# Altium project RGBWLEDDriver.PrjPcb
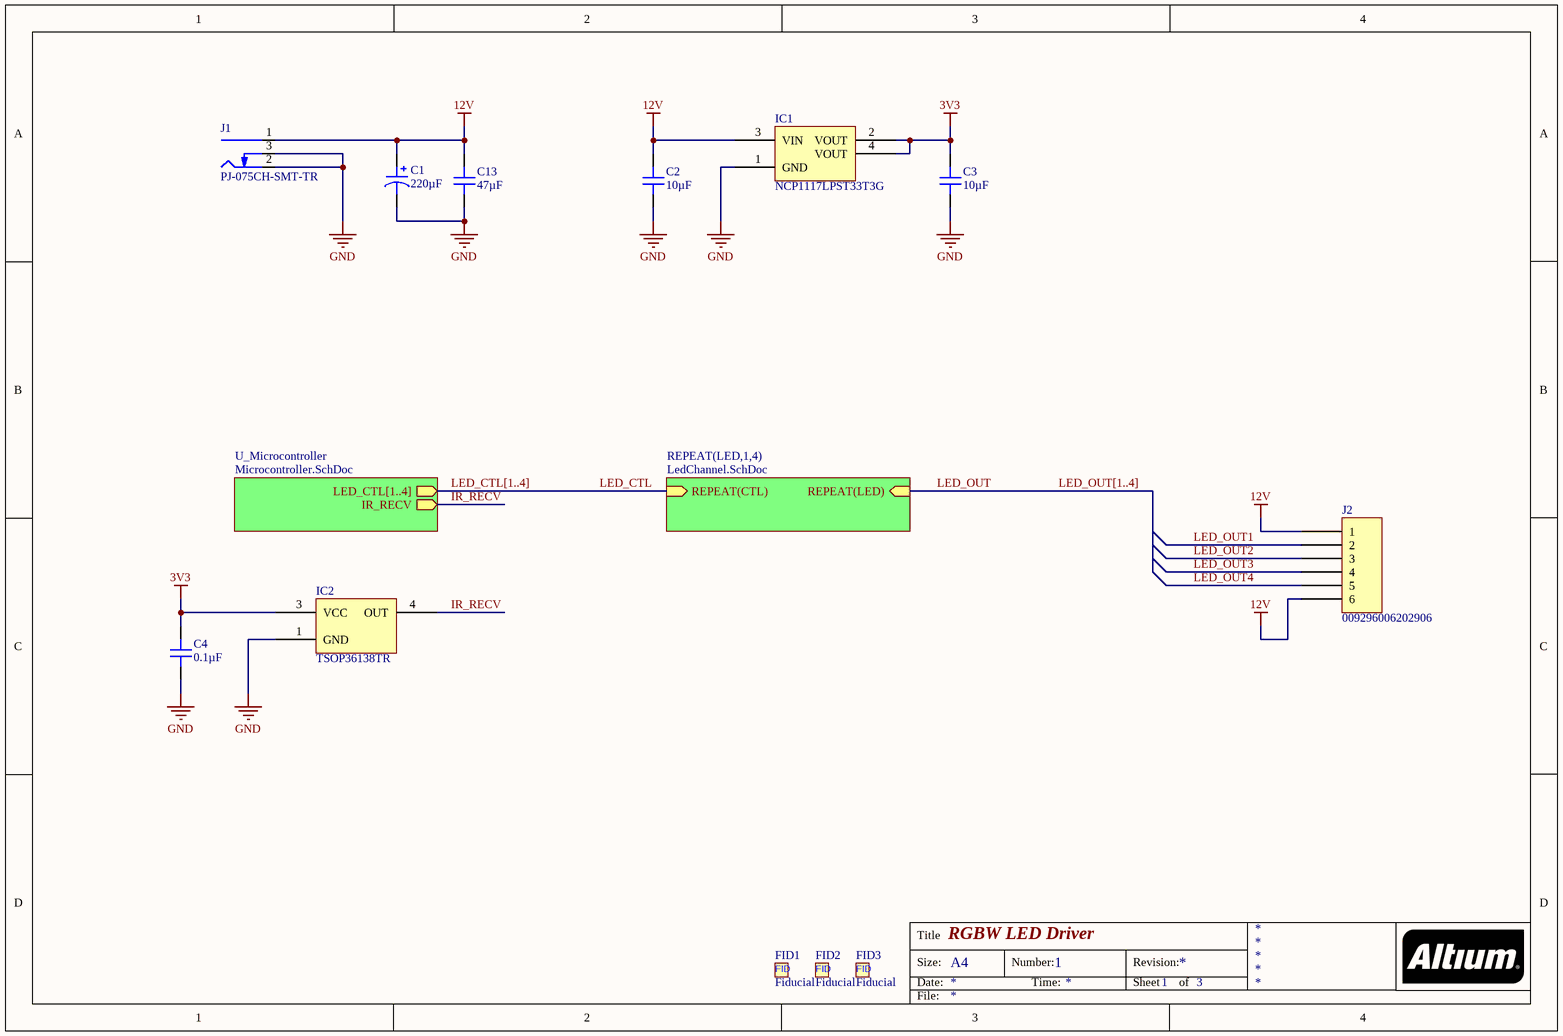
[diagram p0: Top.SchDoc]
3 sheets, 53 parts. Net scope: hierarchical (ports join the sheet entries above them; power ports are global).
Board files: LED Controller.PcbDoc, LED Controller Panel.PcbDoc
Sheets:
  Top.SchDoc
    U_Microcontroller = Microcontroller.SchDoc
    LED1 = LedChannel.SchDoc
    LED2 = LedChannel.SchDoc
    LED3 = LedChannel.SchDoc
    LED4 = LedChannel.SchDoc

## Sheet Top.SchDoc: RGBW LED Driver
size A4; DocumentNumber: 1; SheetNumber: 1; SheetTotal: 3

### Parts
C1  220µF  [CAP ALSMD 8.3MM H10.5MM]
C2  10µF  [CAP 1206_3216 - 1.8MM]
C3  10µF  [CAP 1206_3216 - 1.8MM]
C4  0.1µF  [CAP 0603_1608]
C13  47µF  [CAP 1206_3216 - 1.8MM]
FID1  Fiducial  [Fiducial-1mm]
FID2  Fiducial  [Fiducial-1mm]
FID3  Fiducial  [Fiducial-1mm]
IC1  NCP1117LPST33T3G  [ON SEMI SOT-223 ST(318H)]
IC2  TSOP36138TR  [VISHAY TSOP36X-TR]
J1  PJ-075CH-SMT-TR  [CUI PJ-075-SMT]
J2  009296006202906  [AVX 9296006202806]

### Sub-sheets
REPEAT(LED,1,4) = LedChannel.SchDoc: REPEAT(CTL) (in), REPEAT(LED) (in)
U_Microcontroller = Microcontroller.SchDoc: LED_CTL[1..4] (out), IR_RECV (out)

### Nets
3V3: C3.2 C4.2 IC1.2(VOUT) IC1.4(VOUT) IC2.3(VCC)
12V: C1.1 C2.2 C13.2 IC1.3(VIN) J1.1(Centre) J2.1 J2.6
GND: C1.2 C2.1 C3.1 C4.1 C13.1 IC1.1(GND) IC2.1(GND) J1.2(Outer) J1.3(SW)
IR_RECV: IC2.4(OUT) ; sheet U_Microcontroller/IR_RECV
LED_CTL: sheet REPEAT(LED,1,4)/REPEAT(CTL)
LED_OUT: sheet REPEAT(LED,1,4)/REPEAT(LED)
LED_OUT1: J2.2  [project net LED]
LED_OUT2: J2.3  [project net LED]
LED_OUT3: J2.4  [project net LED]
LED_OUT4: J2.5  [project net LED]

### Buses and harness runs
bus LED_CTL[1..4] = sheet U_Microcontroller/LED_CTL[1..4]
bus LED_OUT[1..4]

### Notes on the sheet
- Title
- Size:
- Date:
- A4
- Number:
- Time:
- Revision:
- Sheet
- of
- File:
- (in symbol Fiducial) FID

### Library data of the parts
C1 = UUX1E221MNL6GS: CAP ALUM 220UF 20% 25V SMD; Manufacturer: Nichicon; Lifetime @ Temp.: 2000 Hrs @ 105°C; Polarization: Polar; Ripple Current @ High Frequency: 367.9mA @ 10kHz; Ripple Current @ Low Frequency: 283mA @ 120Hz; Surface Mount Land Size: 0.327" L x 0.327" W (8.30mm x 8.30mm); Part Number: UUX1E221MNL6GS; Applications: General Purpose; Capacitance: 220µF; ComponentLink1Description: Datasheet; ComponentLink1URL: http://nichicon-us.com/english/products/pdfs/e-uux.pdf; ComponentLink2Description: DigiKey Link; ComponentLink2URL: http://digikey.com/product-detail/en/nichicon/UUX1E221MNL6GS/493-9620-1-ND/3962952; Device Package: Radial, Can - SMD; Height - Seated (Max): 0.413" (10.50mm); LastUpdated: 21/01/2020 04:02:43; Lifecycle Status: Active; Minimum Order: 1; Mounting Type: Surface Mount; Operating Temperature: -55°C ~ 105°C; Package / Case: Radial, Can - SMD; Packaging: TapeAndReel; PartId: 7707; Part Status: Active; Price: 0.16; Series: UUX; Size / Dimension: 0.315" Dia (8.00mm); Supplier 1: DigiKey; Supplier Part Number 1: 493-9620-1-ND; Tolerance: ±20%; Value: 220µF; Voltage - Rated: 25V
C2 C3 = CL31A106KAHNNNE: CAP CER 10UF 25V X5R 1206; Manufacturer: Samsung Electro-Mechanics; Tolerance: ±10%; Part Number: CL31A106KAHNNNE; Value: 10µF; Applications: General Purpose; Capacitance: 10µF; ComponentLink1Description: Datasheet; ComponentLink1URL: http://www.samsungsem.com/kr/support/product-search/mlcc/CL31A106KAHNNNE.jsp; ComponentLink2Description: DigiKey Link; ComponentLink2URL: http://digikey.com/product-detail/en/samsung-electro-mechanics/CL31A106KAHNNNE/1276-1075-1-ND/3889161; Device Package: 1206 (3216 Metric); LastUpdated: 21/01/2020 00:03:42; Lifecycle Status: Active; Minimum Order: 1; Mounting Type: Surface Mount, MLCC; Operating Temperature: -55°C ~ 85°C; Package / Case: 1206 (3216 Metric); Packaging: TapeAndReel; PartId: 21774; Part Status: Active; Price: 0.04; Series: CL; Size / Dimension: 0.126" L x 0.063" W (3.20mm x 1.60mm); Supplier 1: DigiKey; Supplier Part Number 1: 1276-1075-1-ND; Temperature Coefficient: X5R; Thickness (Max): 0.071" (1.80mm); Voltage - Rated: 25V
C4 = CS0603KRX7R7BB104: CAP CER 0.1UF 16V X7R 0603; Manufacturer: Yageo; Tolerance: ±10%; Part Number: CS0603KRX7R7BB104; Value: 0.1µF; Applications: Boardflex Sensitive; Capacitance: 0.1µF; ComponentLink1Description: Datasheet; ComponentLink1URL: http://www.yageo.com/NewPortal/yageodocoutput?fileName=/pdf/MLCC/UPY-ST_NPOX7R_16V-to-3KV_5.pdf; ComponentLink2Description: DigiKey Link; ComponentLink2URL: http://digikey.com/product-detail/en/yageo/CS0603KRX7R7BB104/311-3560-1-ND/7648487; Device Package: 0603 (1608 Metric); Features: Soft Termination; LastUpdated: 02/01/2020 00:02:08; Lifecycle Status: Active; Minimum Order: 1; Mounting Type: Surface Mount, MLCC; Operating Temperature: -55°C ~ 125°C; Package / Case: 0603 (1608 Metric); Packaging: ReReel; PartId: 2286; Part Status: Active; Price: 0.00; Series: CS; Size / Dimension: 0.063" L x 0.031" W (1.60mm x 0.80mm); Supplier 1: DigiKey; Supplier Part Number 1: 311-3560-1-ND; Temperature Coefficient: X7R; Thickness (Max): 0.037" (0.95mm); Voltage - Rated: 16V
C13 = GRM31CR61E476ME44L: CAP CER 47UF 25V X5R 1206; Manufacturer: Murata Electronics; Tolerance: ±20%; Part Number: GRM31CR61E476ME44L; Value: 47µF; Applications: General Purpose; Capacitance: 47µF; ComponentLink2Description: DigiKey Link; ComponentLink2URL: http://digikey.com/product-detail/en/murata-electronics/GRM31CR61E476ME44L/490-16268-1-ND/7363259; Device Package: 1206 (3216 Metric); LastUpdated: 21/01/2020 00:03:34; Lifecycle Status: Active; Minimum Order: 1; Mounting Type: Surface Mount, MLCC; Operating Temperature: -55°C ~ 85°C; Package / Case: 1206 (3216 Metric); Packaging: TapeAndReel; PartId: 22811; Part Status: Active; Price: 0.36; Series: GRM; Size / Dimension: 0.126" L x 0.063" W (3.20mm x 1.60mm); Supplier 1: DigiKey; Supplier Part Number 1: 490-16268-1-ND; Temperature Coefficient: X5R; Thickness (Max): 0.071" (1.80mm); Voltage - Rated: 25V
IC1 = NCP1117LPST33T3G: IC REG LINEAR 3.3V 1A SOT223; Manufacturer: ON Semiconductor; Current - Quiescent (Iq): 700µA; Number of Regulators: 1; Output Configuration: Positive; Output Type: Fixed; Protection Features: Over Current, Over Temperature; PSRR: 60dB (120Hz); Voltage Dropout (Max): 1.4V @ 1A; Voltage - Input (Max): 18V; Part Number: NCP1117LPST33T3G; ComponentLink1Description: Datasheet; ComponentLink1URL: http://www.onsemi.com/pub/Collateral/NCP1117LP-D.PDF; ComponentLink2Description: DigiKey Link; ComponentLink2URL: http://digikey.com/product-detail/en/on-semiconductor/NCP1117LPST33T3G/NCP1117LPST33T3GOSCT-ND/3462387; Current - Output: 1A; Device Package: TO-261-4, TO-261AA; LastUpdated: 21/01/2020 03:56:49; Lifecycle Status: Active; Minimum Order: 1; Mounting Type: Surface Mount; Operating Temperature: 0°C ~ 125°C; Package / Case: TO-261-4, TO-261AA; Packaging: TapeAndReel; Part Status: Active; Price: 0.12; Series: -; Supplier 1: DigiKey; Supplier Part Number 1: NCP1117LPST33T3GOSCT-ND; Supplier Device Package: SOT-223; Voltage - Output (Min/Fixed): 3.3V
IC2 = TSOP36138TR: SENSOR REMOTE REC 38.0KHZ 45M; Manufacturer: Vishay Semiconductor Opto Division; Current - Supply: 350µA; Voltage - Supply: 2.5V ~ 5.5V; Part Number: TSOP36138TR; B.P.F. Center Frequency: 38.0kHz; ComponentLink1Description: Datasheet; ComponentLink1URL: http://www.vishay.com/docs/82567/tsop361.pdf; ComponentLink2Description: DigiKey Link; ComponentLink2URL: http://digikey.com/product-detail/en/vishay-semiconductor-opto-division/TSOP36138TR/TSOP36138TRCT-ND/8556857; LastUpdated: 20/04/2020 13:27:50; Lifecycle Status: Active; Minimum Order: 1; Mounting Type: Surface Mount; Operating Temperature: -25°C ~ 85°C (TA); Orientation: Side or Top View; Packaging: TapeAndReel; Part Status: Active; Price: 0.71; Sensing Distance: 45m; Series: -; Supplier 1: DigiKey; Supplier Part Number 1: TSOP36138TRCT-ND
J1 = PJ-075CH-SMT-TR: CONN PWR JACK 1X3.4MM SOLDER; Manufacturer: CUI Devices; Actual Diameter: 0.039" (1.00mm ID), 0.146" (3.70mm OD); Current Rating (Amps): 3.5A; Gender: Male; Industry Recognized Mating Diameter: 1.00mm ID (0.039"), 3.40mm OD (0.134"); Internal Switch(s): Single Switch, Normally Closed; Material Flammability Rating: UL94 V-0; Mating Length/Depth: 0.252" (6.40mm); Number of Positions/Contacts: 2 Conductors, 3 Contacts; Shielding: Unshielded; Voltage - Rated: 24VDC; Part Number: PJ-075CH-SMT-TR; ComponentLink1Description: Datasheet; ComponentLink1URL: https://www.cuidevices.com/product/resource/digikeypdf/pj-075ch-smt-tr.pdf; ComponentLink2Description: DigiKey Link; ComponentLink2URL: //digikey.com/product-detail/en/cui-devices/PJ-075CH-SMT-TR/CP-075CHPJTR-ND/3661519; Connector Type: Jack; Features: Board Guide; LastUpdated: 16/12/2019 19:00:05; Lifecycle Status: 0; Minimum Order: 1; Mounting Type: Surface Mount, Right Angle; Packaging: TapeAndReel; Part Status: Active; Price: 0.56; Series: -; Supplier 1: DigiKey; Supplier Part Number 1: CP-075CHPJTR-ND; Termination: Solder
J2 = 009296006202906: CONN WIRE POKE-IN 6POS SMD RA; Manufacturer: AVX Corporation; Board-Side Pitch: 0.118" (3.00mm); Connector Type: Individual Wires; Number of Positions: 6; Wire Gauge: 20-26 AWG; Part Number: 009296006202906; Cable Pitch: 0.118" (3.00mm); Cable Termination: Poke-In; Color: White; ComponentLink1Description: Datasheet; ComponentLink1URL: http://datasheets.avx.com/PHLPHorizontal_00-9296.pdf; ComponentLink2Description: DigiKey Link; ComponentLink2URL: http://digikey.com/product-detail/en/avx-corporation/009296006202906/478-9537-1-ND/5161731; Contact Finish: Tin; Features: Closed End; LastUpdated: 01/05/2020 07:33:23; Lifecycle Status: Active; Minimum Order: 1; Mounting Type: Surface Mount, Right Angle; Number of Rows: 1; Packaging: TapeAndReel; Part Status: Active; Price: 0.38; Series: 9296; Supplier 1: DigiKey; Supplier Part Number 1: 478-9537-1-ND

## Sheet Microcontroller.SchDoc: Microcontroller
size A4; DocumentNumber: 2; SheetNumber: 2; SheetTotal: 3
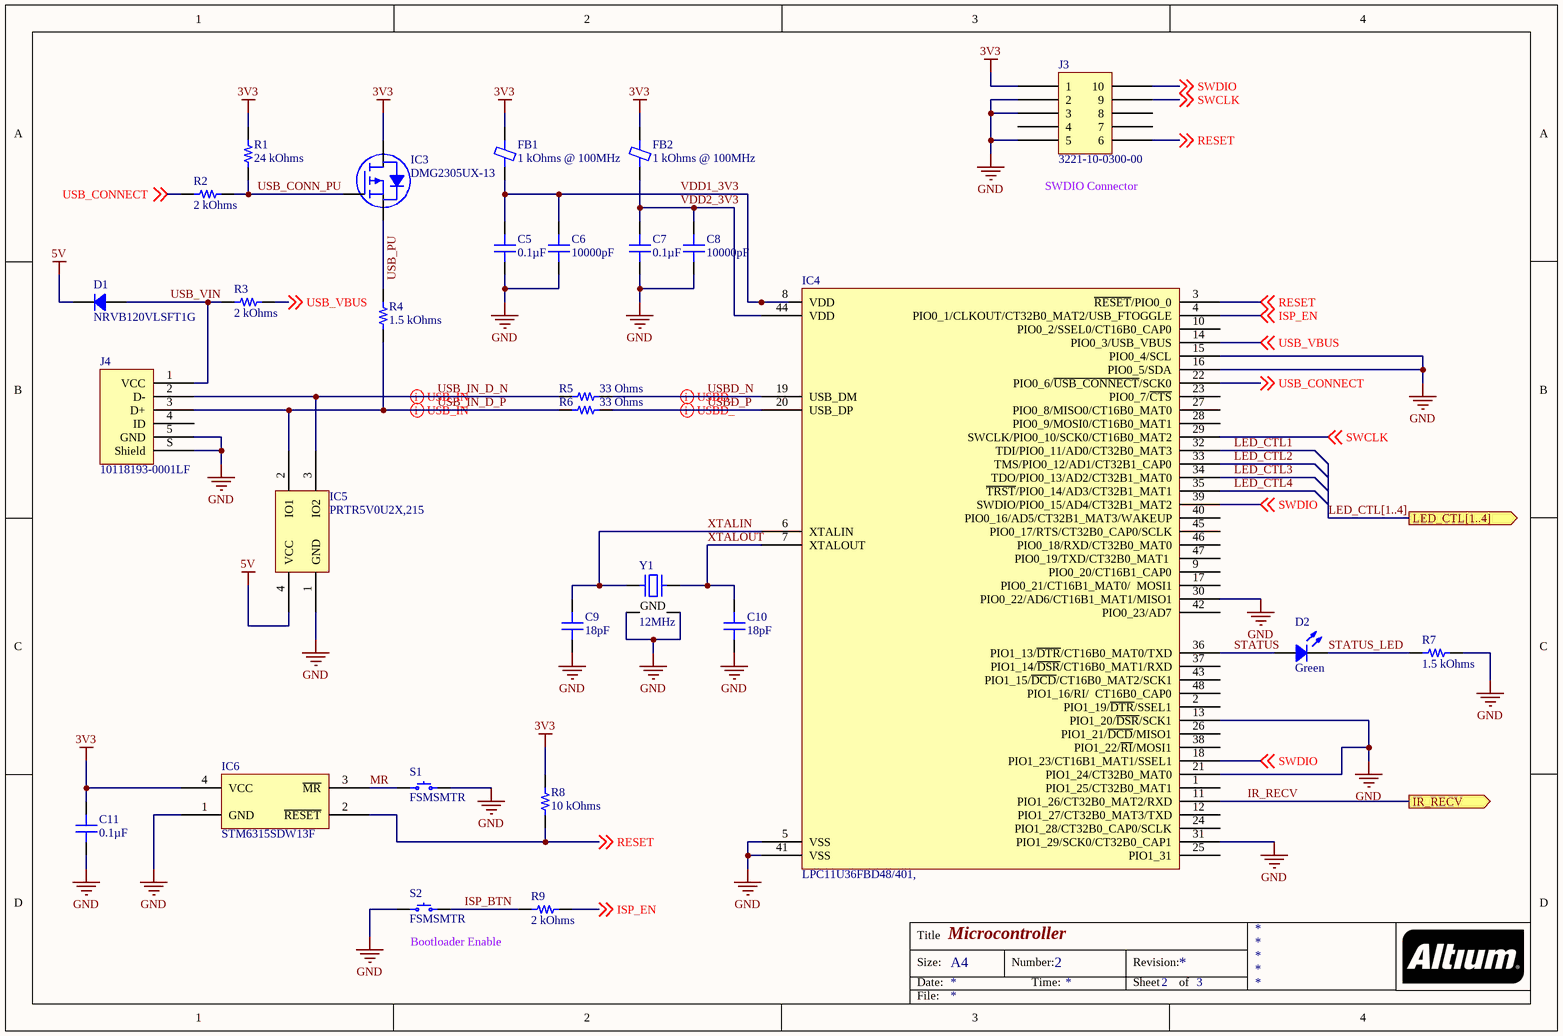
[diagram p1: Microcontroller.SchDoc]

### Parts
C5  0.1µF  [CAP 0603_1608]
C6  10000pF  [CAP 0603_1608]
C7  0.1µF  [CAP 0603_1608]
C8  10000pF  [CAP 0603_1608]
C9  18pF  [CAP 0603_1608]
C10  18pF  [CAP 0603_1608]
C11  0.1µF  [CAP 0603_1608]
D1  NRVB120VLSFT1G  [SOD123F]
D2  Green  [LED 0603_1608 GREEN]
FB1  1 kOhms @ 100MHz  [FER 0603_1608]
FB2  1 kOhms @ 100MHz  [FER 0603_1608]
IC3  DMG2305UX-13  [DIODES SOT-23-3]
IC4  LPC11U36FBD48/401,  [NXP LQFP-48 7X7MM]
IC5  PRTR5V0U2X,215  [SOT143B]
IC6  STM6315SDW13F  [ST SOT-143-4]
J3  3221-10-0300-00  [CNC TECH 3221-10-0300-00]
J4  10118193-0001LF  [FCI USB 10118193-0001LF]
R1  24 kOhms  [RES 0603_1608]
R2  2 kOhms  [RES 0603_1608]
R3  2 kOhms  [RES 0603_1608]
R4  1.5 kOhms  [RES 0603_1608]
R5  33 Ohms  [RES 0603_1608]
R6  33 Ohms  [RES 0603_1608]
R7  1.5 kOhms  [RES 0603_1608]
R8  10 kOhms  [RES 0603_1608]
R9  2 kOhms  [RES 0603_1608]
S1  FSMSMTR  [TE FSMSMTR]
S2  FSMSMTR  [TE FSMSMTR]
Y1  12MHz  [ABRACON ABM8G]

### Ports
IR_RECV (out), LED_CTL[1..4] (out)

### Nets
3V3: C11.2 FB1.2 FB2.2 IC3.3(D) IC6.4(VCC) J3.1 R1.2 R8.2
5V: D1.2 IC5.4(VCC)
GND: C5.1 C6.1 C7.1 C8.1 C9.1 C10.1 C11.1 IC4.5(VSS) IC4.13(PIO1_20/~{DSR}/SCK1) IC4.15(PIO0_4/SCL) IC4.16(PIO0_5/SDA) IC4.21(PIO1_24/CT32B0_MAT0) IC4.30(PIO0_22/AD6/CT16B1_MAT1/MISO1) IC4.31(PIO1_29/SCK0/CT32B0_CAP1) IC4.41(VSS) IC5.1(GND) IC6.1(GND) J3.2 J3.3 J3.5 J4.5(GND) J4.S(Shield) R7.1 S1.2 S2.1 Y1.2(GND) Y1.4(GND)
IR_RECV: IC4.11(PIO1_26/CT32B0_MAT2/RXD) ; port IR_RECV
ISP_BTN: R9.1 S2.2
ISP_EN: IC4.4(PIO0_1/CLKOUT/CT32B0_MAT2/USB_FTOGGLE) R9.2 ; off-sheet ISP_EN
LED_CTL1: IC4.32(TDI/PIO0_11/AD0/CT32B0_MAT3)  [project net CTL]
LED_CTL2: IC4.33(TMS/PIO0_12/AD1/CT32B1_CAP0)  [project net CTL]
LED_CTL3: IC4.34(TDO/PIO0_13/AD2/CT32B1_MAT0)  [project net CTL]
LED_CTL4: IC4.35(~{TRST}/PIO0_14/AD3/CT32B1_MAT1)  [project net CTL]
MR: IC6.3(~{MR}) S1.1
RESET: IC4.3(~{RESET}/PIO0_0) IC6.2(~{RESET}) J3.6 R8.1 ; off-sheet RESET
STATUS: D2.1 IC4.36(PIO1_13/~{DTR}/CT16B0_MAT0/TXD)
STATUS_LED: D2.2 R7.2
SWCLK: IC4.29(SWCLK/PIO0_10/SCK0/CT16B0_MAT2) J3.9 ; off-sheet SWCLK
SWDIO: IC4.18(PIO1_23/CT16B1_MAT1/SSEL1) IC4.39(SWDIO/PIO0_15/AD4/CT32B1_MAT2) J3.10 ; off-sheet SWDIO
USB_CONN_PU: IC3.1(G) R1.1 R2.2
USB_CONNECT: IC4.22(PIO0_6/~{USB_CONNECT}/SCK0) R2.1 ; off-sheet USB_CONNECT
USB_IN_D_N: IC5.3(IO2) J4.2(D-) R5.1
USB_IN_D_P: IC5.2(IO1) J4.3(D+) R4.1 R6.1
USB_PU: IC3.2(S) R4.2
USB_VBUS: IC4.14(PIO0_3/USB_VBUS) R3.2 ; off-sheet USB_VBUS
USB_VIN: D1.1 J4.1(VCC) R3.1
USBD_N: IC4.19(USB_DM) R5.2
USBD_P: IC4.20(USB_DP) R6.2
VDD1_3V3: C5.2 C6.2 FB1.1 IC4.8(VDD)
VDD2_3V3: C7.2 C8.2 FB2.1 IC4.44(VDD)
XTALIN: C9.2 IC4.6(XTALIN) Y1.1
XTALOUT: C10.2 IC4.7(XTALOUT) Y1.3

Not connected (* = marked no-connect by the designer): IC4 1(PIO1_25/CT32B0_MAT1) 2(PIO1_19/~{DTR}/SSEL1) 9(PIO0_20/CT16B1_CAP0) 10(PIO0_2/SSEL0/CT16B0_CAP0) 12(PIO1_27/CT32B0_MAT3/TXD) 17(PIO0_21/CT16B1_MAT0/__MOSI1) 23(PIO0_7/~{CTS}) 24(PIO1_28/CT32B0_CAP0/SCLK) 25(PIO1_31) 26(PIO1_21/~{DCD}/MISO1) 27(PIO0_8/MISO0/CT16B0_MAT0) 28(PIO0_9/MOSI0/CT16B0_MAT1) 37(PIO1_14/~{DSR}/CT16B0_MAT1/RXD) 38(PIO1_22/~{RI}/MOSI1) 40(PIO0_16/AD5/CT32B1_MAT3/WAKEUP) 42(PIO0_23/AD7) 43(PIO1_15/~{DCD}/CT16B0_MAT2/SCK1) 45(PIO0_17/RTS/CT32B0_CAP0/SCLK) 46(PIO0_18/RXD/CT32B0_MAT0) 47(PIO0_19/TXD/CT32B0_MAT1_) 48(PIO1_16/RI/__CT16B0_CAP0); J3 4 7 8; J4 4(ID)

### Buses and harness runs
bus LED_CTL[1..4] = port LED_CTL[1..4]

### Layout directives
differential pair; differential pair class USBD: USB_IN_D_N, USB_IN_D_P, USBD_N, USBD_P

### Notes on the sheet
- (near J3) SWDIO Connector
- Bootloader Enable
- Title
- Size:
- Date:
- A4
- Number:
- Time:
- Revision:
- Sheet
- of
- File:

### Library data of the parts
C5 C7 C11 = CS0603KRX7R7BB104: as C4 on sheet Top; Part Number: CS0603KRX7R7BB104; Value: 0.1µF; Applications: Boardflex Sensitive; Capacitance: 0.1µF; ComponentLink1Description: Datasheet; ComponentLink1URL: http://www.yageo.com/NewPortal/yageodocoutput?fileName=/pdf/MLCC/UPY-ST_NPOX7R_16V-to-3KV_5.pdf; ComponentLink2Description: DigiKey Link; ComponentLink2URL: http://digikey.com/product-detail/en/yageo/CS0603KRX7R7BB104/311-3560-1-ND/7648487; Device Package: 0603 (1608 Metric); Features: Soft Termination; LastUpdated: 02/01/2020 00:02:08; Lifecycle Status: Active; Minimum Order: 1; Mounting Type: Surface Mount, MLCC; Operating Temperature: -55°C ~ 125°C; Package / Case: 0603 (1608 Metric); Packaging: ReReel; PartId: 2286; Part Status: Active; Price: 0.00; Series: CS; Size / Dimension: 0.063" L x 0.031" W (1.60mm x 0.80mm); Supplier 1: DigiKey; Supplier Part Number 1: 311-3560-1-ND; Temperature Coefficient: X7R; Thickness (Max): 0.037" (0.95mm); Voltage - Rated: 16V
C6 C8 = AC0603KPX7R9BB103: CAP CER 10000PF 50V X7R 0603; Manufacturer: Yageo; Tolerance: ±10%; Part Number: AC0603KPX7R9BB103; Value: 10000pF; Applications: Automotive; Capacitance: 10000pF; ComponentLink1Description: Datasheet; ComponentLink1URL: http://www.yageo.com/NewPortal/_en/search/productDocs.jsp?YageoPartNumber=AC0603KPX7R9BB103; ComponentLink2Description: DigiKey Link; ComponentLink2URL: http://digikey.com/product-detail/en/yageo/AC0603KPX7R9BB103/311-3284-1-ND/6643536; Device Package: 0603 (1608 Metric); LastUpdated: 21/01/2020 00:02:05; Lifecycle Status: Active; Minimum Order: 1; Mounting Type: Surface Mount, MLCC; Operating Temperature: -55°C ~ 125°C; Package / Case: 0603 (1608 Metric); Packaging: TapeAndReel; PartId: 5188; Part Status: Active; Price: 0.01; Ratings: AEC-Q200; Series: AC; Size / Dimension: 0.063" L x 0.031" W (1.60mm x 0.80mm); Supplier 1: DigiKey; Supplier Part Number 1: 311-3284-1-ND; Temperature Coefficient: X7R; Thickness (Max): 0.035" (0.90mm); Voltage - Rated: 50V
C9 C10 = C0603C180K5GACTU: CAP CER 18PF 50V C0G/NP0 0603; Manufacturer: KEMET; Temperature Coefficient: C0G, NP0; Tolerance: ±10%; Part Number: C0603C180K5GACTU; Value: 18pF; Applications: General Purpose; Capacitance: 18pF; ComponentLink1Description: Datasheet; ComponentLink1URL: https://api.kemet.com/component-edge/download/datasheet/C0603C180K5GACTU.pdf; ComponentLink2Description: DigiKey Link; ComponentLink2URL: http://digikey.com/product-detail/en/kemet/C0603C180K5GACTU/399-7866-1-ND/3471589; Device Package: 0603 (1608 Metric); Features: Low ESL; LastUpdated: 21/01/2020 00:02:05; Lifecycle Status: Active; Minimum Order: 1; Mounting Type: Surface Mount, MLCC; Operating Temperature: -55°C ~ 125°C; Package / Case: 0603 (1608 Metric); Packaging: TapeAndReel; PartId: 5275; Part Status: Active; Price: 0.01; Series: SMD Comm C0G; Size / Dimension: 0.063" L x 0.031" W (1.60mm x 0.80mm); Supplier 1: DigiKey; Supplier Part Number 1: 399-7866-1-ND; Thickness (Max): 0.034" (0.87mm); Voltage - Rated: 50V
D1 = NRVB120VLSFT1G: DIODE SCHOTTKY 20V 1A SOD123; Manufacturer: ON Semiconductor; Current - Reverse Leakage @ Vr: 15mA @ 20V; Speed: Fast Recovery =< 500ns, > 200mA (Io); Voltage - Forward (Vf) (Max) @ If: 300mV @ 1A; Part Number: NRVB120VLSFT1G; ComponentLink1Description: Datasheet; ComponentLink1URL: http://www.onsemi.com/pub/Collateral/MBR120VLSFT1-D.PDF; ComponentLink2Description: DigiKey Link; ComponentLink2URL: http://digikey.com/product-detail/en/on-semiconductor/NRVB120VLSFT1G/NRVB120VLSFT1GOSCT-ND/8538727; Current - Average Rectified (Io): 1A; Device Package: SOD-123F; Diode Type: Schottky; LastUpdated: 21/01/2020 02:43:37; Lifecycle Status: Active; Minimum Order: 1; Mounting Type: Surface Mount; Operating Temperature - Junction: -65°C ~ 125°C; Package / Case: SOD-123F; Packaging: TapeAndReel; PartId: 2453; Part Status: Active; Price: 0.15; Series: Automotive, AEC-Q101; Supplier 1: DigiKey; Supplier Part Number 1: NRVB120VLSFT1GOSCT-ND; Supplier Device Package: SOD-123FL; Voltage - DC Reverse (Vr) (Max): 20V
D2 = LG Q396-PS-35: LED GREEN DIFFUSED 0603 SMD; Manufacturer: OSRAM Opto Semiconductors Inc.; Configuration: Standard; Current - Test: 20mA; Lens Color: White; Lens Size: 1.00mm x 0.80mm; Lens Style: Rectangle with Flat Top; Millicandela Rating: 163mcd; Viewing Angle: 150°, 120°; Voltage - Forward (Vf) (Typ): 2V; Wavelength - Dominant: 573nm; Part Number: LG Q396-PS-35; Color: Green; ComponentLink1Description: Datasheet; ComponentLink1URL: https://dammedia.osram.info/media/resource/hires/osram-dam-2493948/LG%20Q396.pdf; ComponentLink2Description: DigiKey Link; ComponentLink2URL: http://digikey.com/product-detail/en/osram-opto-semiconductors-inc/LG-Q396-PS-35/475-3754-1-ND/10055035; Device Package: 0603 (1608 Metric); Height (Max): 0.40mm; LastUpdated: 21/01/2020 03:12:08; Lens Transparency: Diffused; Lifecycle Status: Active; Minimum Order: 1; Mounting Type: Surface Mount; Package / Case: 0603 (1608 Metric); Packaging: TapeAndReel; PartId: 681; Part Status: Active; Price: 0.05; Series: CHIPLED 0603; Size / Dimension: 1.60mm L x 0.80mm W; Supplier 1: DigiKey; Supplier Part Number 1: 475-3754-1-ND; Supplier Device Package: 0603; Value: Green
FB1 FB2 = FBTH1608HE102-T: FERRITE BEAD,HIGH CURRENT, 0603; Manufacturer: Taiyo Yuden; Current Rating (Max): 500mA; DC Resistance (DCR) (Max): 350mOhm; Filter Type: Power Line; Number of Lines: 1; Part Number: FBTH1608HE102-T; ComponentLink1Description: Datasheet; ComponentLink1URL: https://ds.yuden.co.jp/TYCOMPAS/ut/detail?pn=FBTH1608HE102-T&u=M; ComponentLink2Description: DigiKey Link; ComponentLink2URL: http://digikey.com/product-detail/en/taiyo-yuden/FBTH1608HE102-T/587-6587-1-ND/10324935; Device Package: 0603 (1608 Metric); Height (Max): 0.037" (0.95mm); Impedance @ Frequency: 1 kOhms @ 100MHz; LastUpdated: 21/01/2020 02:28:14; Lifecycle Status: Active; Minimum Order: 1; Mounting Type: Surface Mount; Operating Temperature: -40°C ~ 150°C; Package / Case: 0603 (1608 Metric); Packaging: TapeAndReel; PartId: 702; Part Status: Active; Price: 0.09; Ratings: AEC-Q200; Series: FB; Size / Dimension: 0.063" L x 0.031" W (1.60mm x 0.80mm); Supplier 1: DigiKey; Supplier Part Number 1: 587-6587-1-ND; Value: 1 kOhms @ 100MHz
IC3 = DMG2305UX-13: MOSFET P-CH 20V 4.2A SOT23; Manufacturer: Diodes Incorporated; Current - Continuous Drain (Id) @ 25°C: 4.2A (Ta); Drive Voltage (Max Rds On,  Min Rds On): 1.8V, 4.5V; FET Type: P-Channel; Gate Charge (Qg) (Max) @ Vgs: 10.2nC @ 4.5V; Input Capacitance (Ciss) (Max) @ Vds: 808pF @ 15V; Power Dissipation (Max): 1.4W (Ta); Rds On (Max) @ Id, Vgs: 52mOhm @ 4.2A, 4.5V; Vgs (Max): ±8V; Vgs(th) (Max) @ Id: 900mV @ 250µA; Part Number: DMG2305UX-13; ComponentLink1Description: Datasheet; ComponentLink1URL: https://www.diodes.com/assets/Datasheets/DMG2305UX.pdf; ComponentLink2Description: DigiKey Link; ComponentLink2URL: http://digikey.com/product-detail/en/diodes-incorporated/DMG2305UX-13/DMG2305UX-13DICT-ND/4251589; Device Package: TO-236-3, SC-59, SOT-23-3; Drain to Source Voltage (Vdss): 20V; LastUpdated: 21/01/2020 04:00:37; Lifecycle Status: Active; Minimum Order: 1; Mounting Type: Surface Mount; Operating Temperature: -55°C ~ 150°C (TJ); Package / Case: TO-236-3, SC-59, SOT-23-3; Packaging: TapeAndReel; Part Status: Active; Price: 0.05; Series: -; Supplier 1: DigiKey; Supplier Part Number 1: DMG2305UX-13DICT-ND; Supplier Device Package: SOT-23; Technology: MOSFET (Metal Oxide)
IC4 = LPC11U36FBD48/401,: IC MCU 32BIT 96KB FLASH 48LQFP; Manufacturer: NXP USA Inc.; Connectivity: I²C, Microwire, SmartCard, SPI, SSP, UART/USART, USB; Core Processor: ARM® Cortex®-M0; Core Size: 32-Bit; Data Converters: A/D 8x10b; EEPROM Size: 4K x 8; Number of I/O: 40; Oscillator Type: Internal; Peripherals: Brown-out Detect/Reset, POR, WDT; Program Memory Size: 96KB (96K x 8); RAM Size: 10K x 8; Speed: 50MHz; Voltage - Supply (Vcc/Vdd): 1.8V ~ 3.6V; Part Number: LPC11U36FBD48/401,; ComponentLink1Description: Datasheet; ComponentLink1URL: https://www.nxp.com/docs/en/data-sheet/LPC11U3X.pdf; ComponentLink2Description: DigiKey Link; ComponentLink2URL: //digikey.com/product-detail/en/nxp-usa-inc/LPC11U36FBD48-401/568-9587-ND/3462840; Device Package: 48-LQFP; LastUpdated: 03/12/2019 15:42:55; Lifecycle Status: 0; Minimum Order: 1; Mounting Type: Surface Mount; Operating Temperature: -40°C ~ 85°C (TA); Package / Case: 48-LQFP; Packaging: Tray; PartId: 24; Part Status: Active; Price: 5.04; Program Memory Type: FLASH; Series: LPC11Uxx; Supplier 1: DigiKey; Supplier Part Number 1: 568-9587-ND; Supplier Device Package: 48-LQFP (7x7)
IC5 = PRTR5V0U2X,215: TVS DIODE 5.5V SOT143B; Manufacturer: Nexperia USA Inc.; Capacitance @ Frequency: 1pF @ 1MHz; Power Line Protection: Yes; Unidirectional Channels: 2; Voltage - Breakdown (Min): 6V; Voltage - Reverse Standoff (Typ): 5.5V (Max); Part Number: PRTR5V0U2X,215; Applications: General Purpose; ComponentLink1Description: Datasheet; ComponentLink1URL: https://assets.nexperia.com/documents/data-sheet/PRTR5V0U2X.pdf; ComponentLink2Description: DigiKey Link; ComponentLink2URL: //digikey.com/product-detail/en/nexperia-usa-inc/PRTR5V0U2X215/1727-3884-2-ND/1163690; Device Package: TO-253-4, TO-253AA; LastUpdated: 09/12/2019 21:29:05; Lifecycle Status: 0; Minimum Order: 1; Mounting Type: Surface Mount; Operating Temperature: -40°C ~ 85°C (TA); Package / Case: TO-253-4, TO-253AA; Packaging: TapeAndReel; PartId: 5451; Part Status: Active; Price: 0.18; Series: -; Supplier 1: DigiKey; Supplier Part Number 1: 1727-3884-2-ND; Supplier Device Package: SOT-143B; Type: Steering (Rail to Rail)
IC6 = STM6315SDW13F: IC SUPERVISOR 1 CHANNEL SOT143-4; Manufacturer: STMicroelectronics; Number of Voltages Monitored: 1; Output: Open Drain or Open Collector; Reset: Active Low; Reset Timeout: 112ms Minimum; Voltage - Threshold: 2.93V; Part Number: STM6315SDW13F; ComponentLink1Description: Datasheet; ComponentLink1URL: http://www.st.com/content/ccc/resource/technical/document/datasheet/64/6b/44/43/61/e6/41/d5/CD00081393.pdf/files/CD00081393.pdf/jcr:content/translations/en.CD00081393.pdf; ComponentLink2Description: DigiKey Link; ComponentLink2URL: http://digikey.com/product-detail/en/stmicroelectronics/STM6315SDW13F/497-4975-1-ND/1003446; Device Package: TO-253-4, TO-253AA; LastUpdated: 21/01/2020 03:59:26; Lifecycle Status: Active; Minimum Order: 1; Mounting Type: Surface Mount; Operating Temperature: -40°C ~ 125°C (TA); Package / Case: TO-253-4, TO-253AA; Packaging: TapeAndReel; Part Status: Active; Price: 0.23; Series: -; Supplier 1: DigiKey; Supplier Part Number 1: 497-4975-1-ND; Supplier Device Package: SOT-143-4; Type: Simple Reset/Power-On Reset
J3 = 3221-10-0300-00: CONN HEADER SMD 10POS 1.27MM; Manufacturer: CNC Tech; Current Rating (Amps): 1A; Material Flammability Rating: UL94 V-0; Number of Positions: 10; Number of Positions Loaded: All; Pitch - Mating: 0.050" (1.27mm); Shrouding: Shrouded - 4 Wall; Style: Board to Cable/Wire; Part Number: 3221-10-0300-00; ComponentLink1Description: Datasheet; ComponentLink1URL: http://cnctech.us/idcmatching2.pdf; ComponentLink2Description: DigiKey Link; ComponentLink2URL: http://digikey.com/product-detail/en/cnc-tech/3221-10-0300-00/1175-1735-ND/4878946; Connector Type: Header; Contact Finish - Mating: Gold; Contact Finish - Post: Gold; Contact Finish Thickness - Mating: Flash; Contact Material: Brass; Contact Shape: Square; Contact Type: Male Pin; Fastening Type: Push-Pull; Features: Keying Slot; Insulation Height: 0.213" (5.40mm); Insulation Material: Polyamide (PA6T), Nylon 6T; LastUpdated: 13/01/2020 00:09:21; Lifecycle Status: Active; Minimum Order: 1; Mounting Type: Surface Mount; Number of Rows: 2; Operating Temperature: -40°C ~ 105°C; Packaging: Tray; PartId: 109; Part Status: Active; Price: 0.73; Row Spacing - Mating: 0.050" (1.27mm); Series: -; Supplier 1: DigiKey; Supplier Part Number 1: 1175-1735-ND; Termination: Solder
J4 = 10118193-0001LF: CONN RCPT USB2.0 MICRO B SMD R/A; Manufacturer: Amphenol ICC (FCI); Connector Type: USB - micro B; Current Rating (Amps): 1.8A per Contact; Gender: Receptacle; Mating Cycles: 10000; Number of Contacts: 5; Number of Ports: 1; Shielding: Shielded; Voltage - Rated: 100VAC; Part Number: 10118193-0001LF; ComponentLink1Description: Datasheet; ComponentLink1URL: https://cdn.amphenol-icc.com/media/wysiwyg/files/documentation/datasheet/inputoutput/io_usb_micro.pdf; ComponentLink2Description: DigiKey Link; ComponentLink2URL: //digikey.com/product-detail/en/amphenol-icc-fci/10118193-0001LF/609-4616-2-ND/2785388; Features: Solder Retention; LastUpdated: 09/12/2019 20:51:28; Lifecycle Status: 0; Minimum Order: 1; Mounting Feature: Horizontal; Mounting Type: Surface Mount, Right Angle; Through Hole; Operating Temperature: -30°C ~ 80°C; Packaging: TapeAndReel; Part Status: Active; Price: 0.21; Series: -; Specifications: USB 2.0; Supplier 1: DigiKey; Supplier Part Number 1: 609-4616-2-ND; Termination: Solder
R1 = ERJ-3EKF2402V: RES SMD 24K OHM 1% 1/10W 0603; Manufacturer: Panasonic Electronic Components; Power (Watts): 0.1W, 1/10W; Temperature Coefficient: ±100ppm/°C; Part Number: ERJ-3EKF2402V; Value: 24 kOhms; ComponentLink1Description: Datasheet; ComponentLink1URL: https://industrial.panasonic.com/cdbs/www-data/pdf/RDA0000/AOA0000C304.pdf; ComponentLink2Description: DigiKey Link; ComponentLink2URL: http://digikey.com/product-detail/en/panasonic-electronic-components/ERJ-3EKF2402V/P24.0KHCT-ND/1746748; Composition: Thick Film; Device Package: 0603 (1608 Metric); Features: Automotive AEC-Q200; Height - Seated (Max): 0.022" (0.55mm); LastUpdated: 21/01/2020 00:17:12; Lifecycle Status: Active; Minimum Order: 1; Number of Terminations: 2; Operating Temperature: -55°C ~ 155°C; Package / Case: 0603 (1608 Metric); Packaging: TapeAndReel; PartId: 23079; Part Status: Active; Price: 0.01; Ratings: AEC-Q200; Resistance: 24 kOhms; Series: ERJ; Size / Dimension: 0.063" L x 0.031" W (1.60mm x 0.80mm); Supplier 1: DigiKey; Supplier Part Number 1: P24.0KHCT-ND; Supplier Device Package: 0603; Tolerance: ±1%
R2 = ERJ-3EKF2001V: RES SMD 2K OHM 1% 1/10W 0603; Manufacturer: Panasonic Electronic Components; Power (Watts): 0.1W, 1/10W; Temperature Coefficient: ±100ppm/°C; Part Number: ERJ-3EKF2001V; Value: 2 kOhms; ComponentLink1Description: Datasheet; ComponentLink1URL: https://industrial.panasonic.com/cdbs/www-data/pdf/RDA0000/AOA0000C304.pdf; ComponentLink2Description: DigiKey Link; ComponentLink2URL: http://digikey.com/product-detail/en/panasonic-electronic-components/ERJ-3EKF2001V/P2.00KHCT-ND/198219; Composition: Thick Film; Device Package: 0603 (1608 Metric); Features: Automotive AEC-Q200; Height - Seated (Max): 0.022" (0.55mm); LastUpdated: 21/01/2020 00:14:57; Lifecycle Status: Active; Minimum Order: 1; Number of Terminations: 2; Operating Temperature: -55°C ~ 155°C; Package / Case: 0603 (1608 Metric); Packaging: TapeAndReel; PartId: 25697; Part Status: Active; Price: 0.01; Ratings: AEC-Q200; Resistance: 2 kOhms; Series: ERJ; Size / Dimension: 0.063" L x 0.031" W (1.60mm x 0.80mm); Supplier 1: DigiKey; Supplier Part Number 1: P2.00KHCT-ND; Supplier Device Package: 0603; Tolerance: ±1%
R3 R9 = ERJ-PA3J202V: RES SMD 2K OHM 5% 1/4W 0603; Manufacturer: Panasonic Electronic Components; Power (Watts): 0.25W, 1/4W; Temperature Coefficient: ±200ppm/°C; Part Number: ERJ-PA3J202V; Value: 2 kOhms; ComponentLink1Description: Datasheet; ComponentLink1URL: https://industrial.panasonic.com/cdbs/www-data/pdf/RDO0000/AOA0000C331.pdf; ComponentLink2Description: DigiKey Link; ComponentLink2URL: http://digikey.com/product-detail/en/panasonic-electronic-components/ERJ-PA3J202V/P2KBZCT-ND/5036279; Composition: Thick Film; Device Package: 0603 (1608 Metric); Features: Automotive AEC-Q200, Pulse Withstanding; Height - Seated (Max): 0.022" (0.55mm); LastUpdated: 21/01/2020 00:23:23; Lifecycle Status: Active; Minimum Order: 1; Number of Terminations: 2; Operating Temperature: -55°C ~ 155°C; Package / Case: 0603 (1608 Metric); Packaging: TapeAndReel; PartId: 8961; Part Status: Active; Price: 0.01; Ratings: AEC-Q200; Resistance: 2 kOhms; Series: ERJ; Size / Dimension: 0.063" L x 0.031" W (1.60mm x 0.80mm); Supplier 1: DigiKey; Supplier Part Number 1: P2KBZCT-ND; Supplier Device Package: 0603; Tolerance: ±5%
R4 R7 = ERJ-3EKF1501V: RES SMD 1.5K OHM 1% 1/10W 0603; Manufacturer: Panasonic Electronic Components; Power (Watts): 0.1W, 1/10W; Temperature Coefficient: ±100ppm/°C; Part Number: ERJ-3EKF1501V; Value: 1.5 kOhms; ComponentLink1Description: Datasheet; ComponentLink1URL: https://industrial.panasonic.com/cdbs/www-data/pdf/RDA0000/AOA0000C304.pdf; ComponentLink2Description: DigiKey Link; ComponentLink2URL: http://digikey.com/product-detail/en/panasonic-electronic-components/ERJ-3EKF1501V/P1.50KHCT-ND/198088; Composition: Thick Film; Device Package: 0603 (1608 Metric); Features: Automotive AEC-Q200; Height - Seated (Max): 0.022" (0.55mm); LastUpdated: 21/01/2020 00:24:38; Lifecycle Status: Active; Minimum Order: 1; Number of Terminations: 2; Operating Temperature: -55°C ~ 155°C; Package / Case: 0603 (1608 Metric); Packaging: TapeAndReel; PartId: 5637; Part Status: Active; Price: 0.01; Ratings: AEC-Q200; Resistance: 1.5 kOhms; Series: ERJ; Size / Dimension: 0.063" L x 0.031" W (1.60mm x 0.80mm); Supplier 1: DigiKey; Supplier Part Number 1: P1.50KHCT-ND; Supplier Device Package: 0603; Tolerance: ±1%
R5 R6 = ERJ-3EKF33R0V: RES SMD 33 OHM 1% 1/10W 0603; Manufacturer: Panasonic Electronic Components; Power (Watts): 0.1W, 1/10W; Temperature Coefficient: ±100ppm/°C; Part Number: ERJ-3EKF33R0V; Value: 33 Ohms; ComponentLink1Description: Datasheet; ComponentLink1URL: https://industrial.panasonic.com/cdbs/www-data/pdf/RDA0000/AOA0000C304.pdf; ComponentLink2Description: DigiKey Link; ComponentLink2URL: http://digikey.com/product-detail/en/panasonic-electronic-components/ERJ-3EKF33R0V/P33.0HCT-ND/1746765; Composition: Thick Film; Device Package: 0603 (1608 Metric); Features: Automotive AEC-Q200; Height - Seated (Max): 0.022" (0.55mm); LastUpdated: 21/01/2020 00:24:38; Lifecycle Status: Active; Minimum Order: 1; Number of Terminations: 2; Operating Temperature: -55°C ~ 155°C; Package / Case: 0603 (1608 Metric); Packaging: TapeAndReel; PartId: 5660; Part Status: Active; Price: 0.01; Ratings: AEC-Q200; Resistance: 33 Ohms; Series: ERJ; Size / Dimension: 0.063" L x 0.031" W (1.60mm x 0.80mm); Supplier 1: DigiKey; Supplier Part Number 1: P33.0HCT-ND; Supplier Device Package: 0603; Tolerance: ±1%
R8 = ERJ-3EKF1002V: RES SMD 10K OHM 1% 1/10W 0603; Manufacturer: Panasonic Electronic Components; Power (Watts): 0.1W, 1/10W; Temperature Coefficient: ±100ppm/°C; Part Number: ERJ-3EKF1002V; Value: 10 kOhms; ComponentLink1Description: Datasheet; ComponentLink1URL: https://industrial.panasonic.com/cdbs/www-data/pdf/RDA0000/AOA0000C304.pdf; ComponentLink2Description: DigiKey Link; ComponentLink2URL: http://digikey.com/product-detail/en/panasonic-electronic-components/ERJ-3EKF1002V/P10.0KHCT-ND/198102; Composition: Thick Film; Device Package: 0603 (1608 Metric); Features: Automotive AEC-Q200; Height - Seated (Max): 0.022" (0.55mm); LastUpdated: 21/01/2020 00:14:57; Lifecycle Status: Active; Minimum Order: 1; Number of Terminations: 2; Operating Temperature: -55°C ~ 155°C; Package / Case: 0603 (1608 Metric); Packaging: TapeAndReel; PartId: 25695; Part Status: Active; Price: 0.01; Ratings: AEC-Q200; Resistance: 10 kOhms; Series: ERJ; Size / Dimension: 0.063" L x 0.031" W (1.60mm x 0.80mm); Supplier 1: DigiKey; Supplier Part Number 1: P10.0KHCT-ND; Supplier Device Package: 0603; Tolerance: ±1%
S1 S2 = FSMSMTR: SWITCH TACTILE SPST-NO 0.05A 24V; Manufacturer: TE Connectivity ALCOSWITCH Switches; Actuator Height off PCB, Vertical: 4.57mm; Actuator Orientation: Top Actuated; Actuator Type: Standard; Contact Rating @ Voltage: 0.05A @ 24VDC; Illumination: Non-Illuminated; Operating Force: 180gf; Outline: 6.00mm x 3.50mm; Switch Function: Off-Mom; Part Number: FSMSMTR; Circuit: SPST-NO; ComponentLink1Description: Datasheet; ComponentLink1URL: https://www.te.com/commerce/DocumentDelivery/DDEController?Action=srchrtrv&DocNm=1437566-3&DocType=Customer+Drawing&DocLang=English; ComponentLink2Description: DigiKey Link; ComponentLink2URL: http://digikey.com/product-detail/en/te-connectivity-alcoswitch-switches/FSMSMTR/450-1758-1-ND/2271637; LastUpdated: 25/01/2020 20:03:55; Lifecycle Status: Active; Minimum Order: 1; Mounting Type: Surface Mount; Operating Temperature: -35°C ~ 85°C; Packaging: TapeAndReel; Part Status: Active; Price: 0.19; Series: FSMSM; Supplier 1: DigiKey; Supplier Part Number 1: 450-1758-1-ND; Termination Style: Gull Wing
Y1 = ABM8G-106-12.000MHZ-T: IOT 12MHZ 10PF XTAL; Manufacturer: Abracon LLC; ESR (Equivalent Series Resistance): 120 Ohms; Frequency Stability: ±30ppm; Frequency Tolerance: ±20ppm; Operating Mode: Fundamental; Part Number: ABM8G-106-12.000MHZ-T; ComponentLink1Description: Datasheet; ComponentLink1URL: https://abracon.com/datasheets/ABM8G-106-12.000MHz-T.pdf; ComponentLink2Description: DigiKey Link; ComponentLink2URL: http://digikey.com/product-detail/en/abracon-llc/ABM8G-106-12.000MHZ-T/535-14512-1-ND/8827203; Device Package: 4-SMD, No Lead; Frequency: 12MHz; Height - Seated (Max): 0.039" (1.00mm); LastUpdated: 15/01/2020 00:15:56; Lifecycle Status: Active; Load Capacitance: 10pF; Minimum Order: 1; Mounting Type: Surface Mount; Operating Temperature: -40°C ~ 85°C; Package / Case: 4-SMD, No Lead; Packaging: TapeAndReel; PartId: 308; Part Status: Active; Price: 0.26; Series: ABM8G; Size / Dimension: 0.126" L x 0.098" W (3.20mm x 2.50mm); Supplier 1: DigiKey; Supplier Part Number 1: 535-14512-1-ND; Type: MHz Crystal; Value: 12MHz

## Sheet LedChannel.SchDoc: LED Channel
size A4; DocumentNumber: 3; SheetNumber: 3; SheetTotal: 3
Used 4 times, as channels LED1, LED2, LED3, LED4. Parts and nets are listed once, with the designators drawn on the sheet.
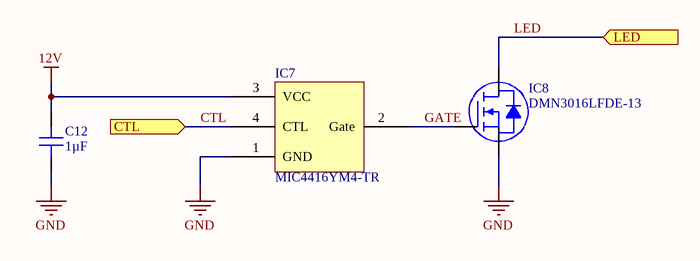
[diagram p2: LedChannel.SchDoc]

### Parts
C12  1µF  [CAP 0603_1608]
IC7  MIC4416YM4-TR  [MICROCHIP SOT-143-4]
IC8  DMN3016LFDE-13  [DIODES U-DFN2020-6E]

### Ports
CTL (in), LED (in)

### Nets
12V: C12.2 IC7.3(VCC)
GND: C12.1 IC7.1(GND) IC8.S
CTL: IC7.4(CTL) ; port CTL
GATE: IC7.2(Gate) IC8.G
LED: IC8.D(Drain) ; port LED

### Channels
LED1: designators end in _LED1; ports CTL=CTL LED=LED
LED2: designators end in _LED2; ports CTL=CTL LED=LED
LED3: designators end in _LED3; ports CTL=CTL LED=LED
LED4: designators end in _LED4; ports CTL=CTL LED=LED

### Notes on the sheet
- Title
- Size:
- Date:
- A4
- Number:
- Time:
- Revision:
- Sheet
- of
- File:

### Library data of the parts
C12 = CL10A105KA8NFNC: CAP CER 1UF 25V X5R 0603; Manufacturer: Samsung Electro-Mechanics; Tolerance: ±10%; Part Number: CL10A105KA8NFNC; Value: 1µF; Applications: General Purpose; Capacitance: 1µF; ComponentLink1Description: Datasheet; ComponentLink1URL: http://www.samsungsem.com/kr/support/product-search/mlcc/CL10A105KA8NFNC.jsp; ComponentLink2Description: DigiKey Link; ComponentLink2URL: http://digikey.com/product-detail/en/samsung-electro-mechanics/CL10A105KA8NFNC/1276-1859-1-ND/3889945; Device Package: 0603 (1608 Metric); LastUpdated: 21/01/2020 00:01:49; Lifecycle Status: Active; Minimum Order: 1; Mounting Type: Surface Mount, MLCC; Operating Temperature: -55°C ~ 85°C; Package / Case: 0603 (1608 Metric); Packaging: TapeAndReel; PartId: 14268; Part Status: Active; Price: 0.01; Series: CL; Size / Dimension: 0.063" L x 0.031" W (1.60mm x 0.80mm); Supplier 1: DigiKey; Supplier Part Number 1: 1276-1859-1-ND; Temperature Coefficient: X5R; Thickness (Max): 0.035" (0.90mm); Voltage - Rated: 25V
IC7 = MIC4416YM4-TR: IC GATE DRVR LOW-SIDE SOT143; Manufacturer: Microchip Technology; Channel Type: Single; Current - Peak Output (Source, Sink): 1.2A, 1.2A; Gate Type: N-Channel MOSFET; Input Type: Non-Inverting; Logic Voltage - VIL, VIH: 0.8V, 2.4V; Number of Drivers: 1; Rise / Fall Time (Typ): 14ns, 16ns; Voltage - Supply: 4.5V ~ 18V; Part Number: MIC4416YM4-TR; ComponentLink1Description: Datasheet; ComponentLink1URL: http://www.microchip.com/mymicrochip/filehandler.aspx?ddocname=en579163; ComponentLink2Description: DigiKey Link; ComponentLink2URL: http://digikey.com/product-detail/en/microchip-technology/MIC4416YM4-TR/576-1187-1-ND/771864; Device Package: TO-253-4, TO-253AA; Driven Configuration: Low-Side; LastUpdated: 31/01/2020 01:32:45; Lifecycle Status: Active; Minimum Order: 1; Mounting Type: Surface Mount; Operating Temperature: -40°C ~ 150°C (TJ); Package / Case: TO-253-4, TO-253AA; Packaging: TapeAndReel; PartId: 7; Part Status: Active; Price: 0.68; Series: IttyBitty®; Supplier 1: DigiKey; Supplier Part Number 1: 576-1187-1-ND; Supplier Device Package: SOT-143
IC8 = DMN3016LFDE-13: MOSFET N-CH 30V U-DFN2020-6; Manufacturer: Diodes Incorporated; Current - Continuous Drain (Id) @ 25°C: 10A (Ta); Drive Voltage (Max Rds On,  Min Rds On): 4.5V, 10V; FET Type: N-Channel; Gate Charge (Qg) (Max) @ Vgs: 25.1nC @ 10V; Input Capacitance (Ciss) (Max) @ Vds: 1415pF @ 15V; Power Dissipation (Max): 730mW (Ta); Rds On (Max) @ Id, Vgs: 12mOhm @ 11A, 10V; Vgs (Max): ±20V; Vgs(th) (Max) @ Id: 2V @ 250µA; Part Number: DMN3016LFDE-13; ComponentLink1Description: Datasheet; ComponentLink1URL: https://www.diodes.com/assets/Datasheets/DMN3016LFDE.pdf; ComponentLink2Description: DigiKey Link; ComponentLink2URL: http://digikey.com/product-detail/en/diodes-incorporated/DMN3016LFDE-13/DMN3016LFDE-13DICT-ND/8545930; Device Package: 6-UDFN Exposed Pad; Drain to Source Voltage (Vdss): 30V; LastUpdated: 30/03/2020 13:01:59; Lifecycle Status: Active; Minimum Order: 1; Mounting Type: Surface Mount; Operating Temperature: -55°C ~ 150°C (TJ); Package / Case: 6-UDFN Exposed Pad; Packaging: TapeAndReel; Part Status: Active; Price: 0.10; Series: -; Supplier 1: DigiKey; Supplier Part Number 1: DMN3016LFDE-13DICT-ND; Supplier Device Package: U-DFN2020-6 (Type E); Technology: MOSFET (Metal Oxide)

## Nets that join several sheets
3V3: Top (5 pins), Microcontroller (8 pins)
12V: Top (7 pins), LED1 (C12_LED1.2 IC7_LED1.3), LED2 (C12_LED2.2 IC7_LED2.3), LED3 (C12_LED3.2 IC7_LED3.3), LED4 (C12_LED4.2 IC7_LED4.3)
GND: Top (9 pins), Microcontroller (27 pins), LED1 (C12_LED1.1 IC7_LED1.1 IC8_LED1.S), LED2 (C12_LED2.1 IC7_LED2.1 IC8_LED2.S), LED3 (C12_LED3.1 IC7_LED3.1 IC8_LED3.S), LED4 (C12_LED4.1 IC7_LED4.1 IC8_LED4.S)
CTL: Microcontroller (IC4.32), LED1 (IC7_LED1.4)
CTL: Microcontroller (IC4.33), LED2 (IC7_LED2.4)
CTL: Microcontroller (IC4.34), LED3 (IC7_LED3.4)
CTL: Microcontroller (IC4.35), LED4 (IC7_LED4.4)
IR_RECV: Top (IC2.4), Microcontroller (IC4.11)
LED: Top (J2.2), LED1 (IC8_LED1.D)
LED: Top (J2.3), LED2 (IC8_LED2.D)
LED: Top (J2.4), LED3 (IC8_LED3.D)
LED: Top (J2.5), LED4 (IC8_LED4.D)